# EAGLE schematic DA-2000 (EAGLE 9.6.2)
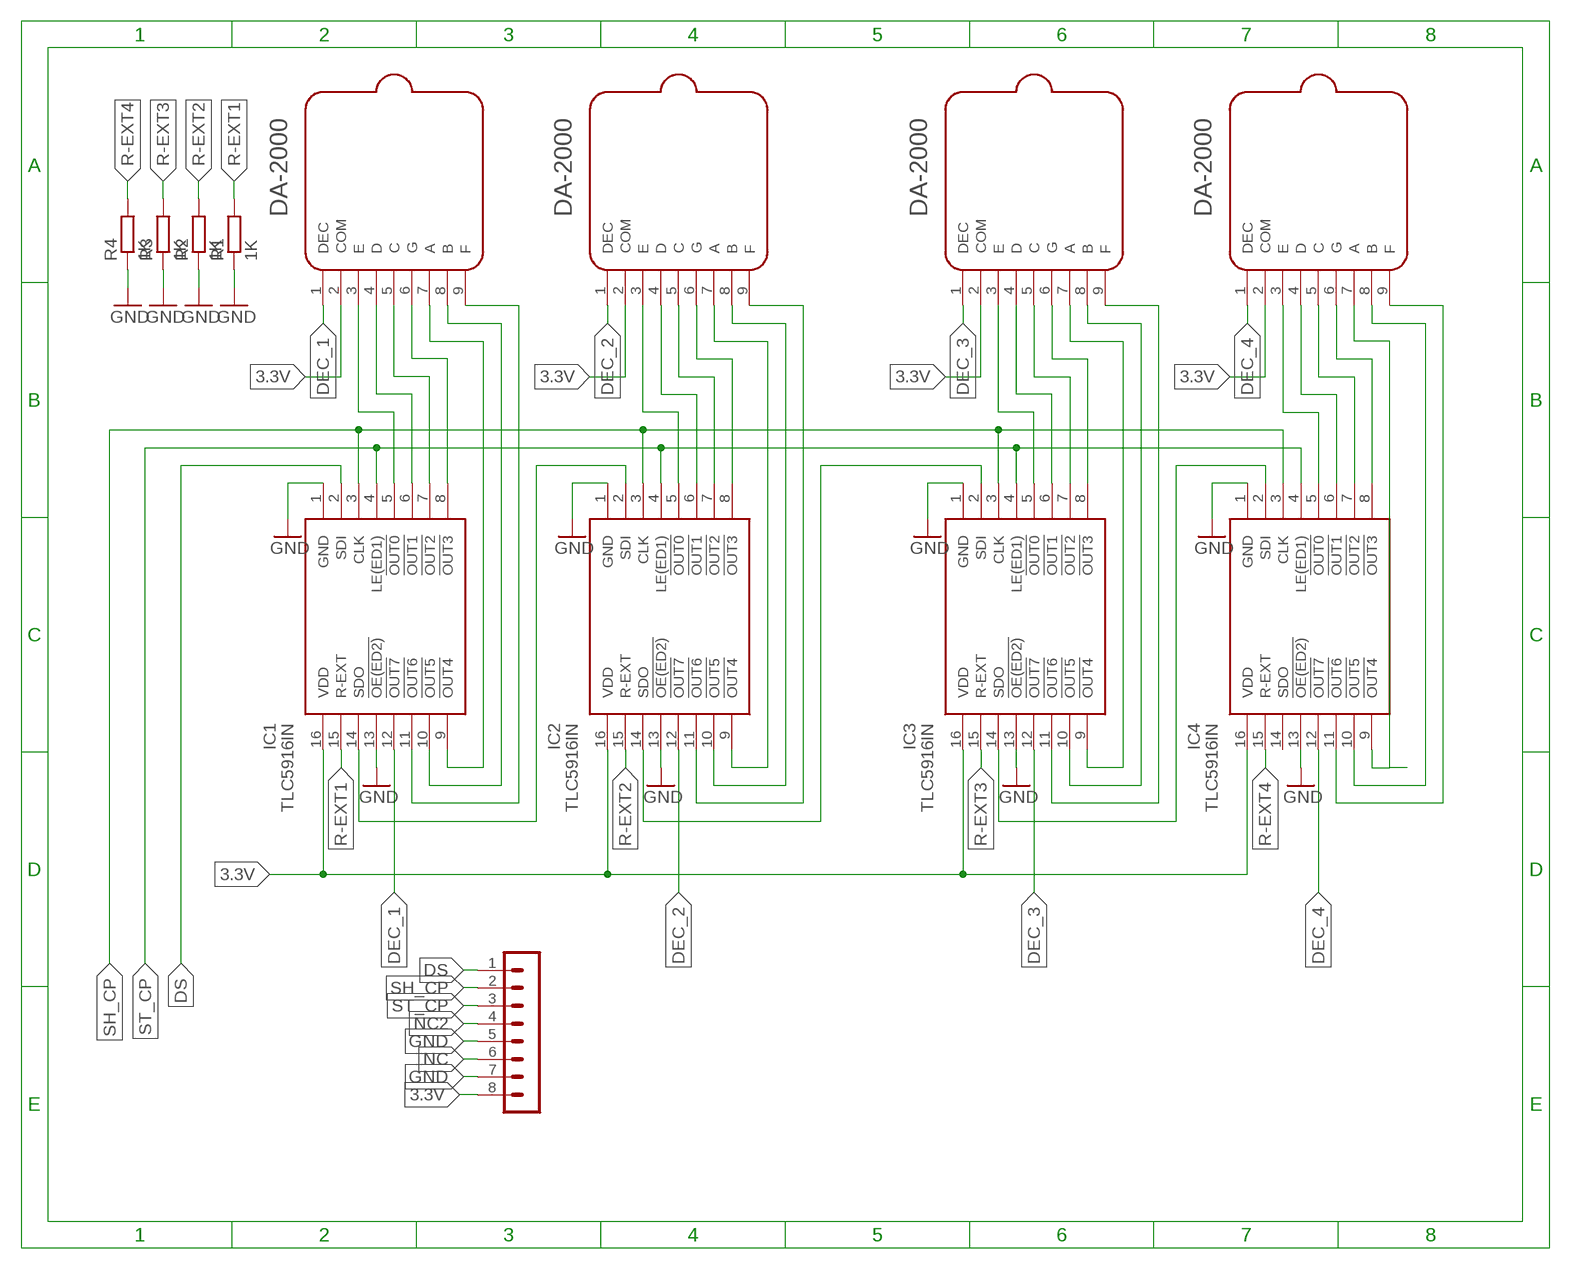
[diagram p0: schematic, sheet 1]

## Parts
IC1  TLC5916IN  [DIP794W53P254L1930H508Q16N]
IC2  TLC5916IN  [DIP794W53P254L1930H508Q16N]
IC3  TLC5916IN  [DIP794W53P254L1930H508Q16N]
IC4  TLC5916IN  [DIP794W53P254L1930H508Q16N]
R1  1K  R-EU_R1206  [R1206]
R2  1K  R-EU_R1206  [R1206]
R3  1K  R-EU_R1206  [R1206]
R4  1K  R-EU_R1206  [R1206]
SV2  PINHEADER-1X8  [MA08-1]
U$1  DA-2000  [DA-2000]
U$2  DA-2000  [DA-2000]
U$3  DA-2000  [DA-2000]
U$4  DA-2000  [DA-2000]

## Nets
3.3V: IC1.16(VDD) IC2.16(VDD) IC3.16(VDD) IC4.16(VDD) SV2.8 U$1.2(COM) U$2.2(COM) U$3.2(COM) U$4.2(COM)
DEC_1: IC1.12(!OUT7) U$1.1(DEC)
DEC_2: IC2.12(!OUT7) U$2.1(DEC)
DEC_3: IC3.12(!OUT7) U$3.1(DEC)
DEC_4: IC4.12(!OUT7) U$4.1(DEC)
DS: IC1.2(SDI) SV2.1
GND: IC1.1(GND) IC1.13(!OE(ED2)) IC2.1(GND) IC2.13(!OE(ED2)) IC3.1(GND) IC3.13(!OE(ED2)) IC4.1(GND) IC4.13(!OE(ED2)) R1.1 R2.1 R3.1 R4.1 SV2.5 SV2.7
N$1: IC3.8(!OUT3) U$3.6(G)
N$2: IC3.9(!OUT4) U$3.7(A)
N$3: IC1.5(!OUT0) U$1.3(E)
N$4: IC1.6(!OUT1) U$1.4(D)
N$5: IC1.7(!OUT2) U$1.5(C)
N$6: IC1.8(!OUT3) U$1.6(G)
N$7: IC4.8(!OUT3) U$4.6(G)
N$8: IC1.9(!OUT4) U$1.7(A)
N$9: IC4.9(!OUT4) U$4.7(A)
N$10: IC1.10(!OUT5) U$1.8(B)
N$11: IC1.11(!OUT6) U$1.9(F)
N$12: IC2.5(!OUT0) U$2.3(E)
N$14: IC2.6(!OUT1) U$2.4(D)
N$33: IC2.7(!OUT2) U$2.5(C)
N$34: IC2.8(!OUT3) U$2.6(G)
N$37: IC2.9(!OUT4) U$2.7(A)
N$38: IC2.10(!OUT5) U$2.8(B)
N$39: IC2.11(!OUT6) U$2.9(F)
N$40: IC3.5(!OUT0) U$3.3(E)
N$41: IC3.6(!OUT1) U$3.4(D)
N$42: IC3.7(!OUT2) U$3.5(C)
N$43: IC4.5(!OUT0) U$4.3(E)
N$44: IC4.6(!OUT1) U$4.4(D)
N$45: IC3.10(!OUT5) U$3.8(B)
N$46: IC3.11(!OUT6) U$3.9(F)
N$47: IC4.7(!OUT2) U$4.5(C)
N$49: IC1.14(SDO) IC2.2(SDI)
N$50: IC4.10(!OUT5) U$4.8(B)
N$51: IC4.11(!OUT6) U$4.9(F)
N$52: IC2.14(SDO) IC3.2(SDI)
N$53: IC3.14(SDO) IC4.2(SDI)
NC: SV2.6
NC2: SV2.4
R-EXT1: IC1.15(R-EXT) R1.2
R-EXT2: IC2.15(R-EXT) R2.2
R-EXT3: IC3.15(R-EXT) R3.2
R-EXT4: IC4.15(R-EXT) R4.2
SH_CP: IC1.3(CLK) IC2.3(CLK) IC3.3(CLK) IC4.3(CLK) SV2.2
ST_CP: IC1.4(LE(ED1)) IC2.4(LE(ED1)) IC3.4(LE(ED1)) IC4.4(LE(ED1)) SV2.3
Unconnected: IC4.14(SDO)

## Library data of the parts
IC1-IC4 = NixieTube:TLC5916IN: 8-CHANNEL CONSTANT-CURRENT LED SINK DRIVERS Source: Datasheet <http://www.ti.com/lit/gpn/tlc5916>; DESCRIPTION: 8-CHANNEL CONSTANT-CURRENT LED SINK DRIVERS; HEIGHT: 5.08mm; MANUFACTURER_NAME: Texas Instruments; MANUFACTURER_PART_NUMBER: TLC5916IN; MOUSER_PART_NUMBER: 595-TLC5916IN; MOUSER_PRICE-STOCK: https://www.mouser.com/Search/Refine.aspx?Keyword=595-TLC5916IN
R1-R4 = rcl:R-EU_: RESISTOR, European symbol; SPICEPREFIX: R
SV2 = CommonParts:PINHEADER-1X8: PIN HEADER; OC_FARNELL: unknown; OC_NEWARK: unknown
U$1-U$4 = NixieTube:DA-2000

## Net classes
0 default: width 0.2 mm, drill 0.3 mm, clearance 0.2 mm
1 other: width 0.2 mm, drill 0.2 mm, clearance 0.2 mm